# Altium schematic sheet full_bridge_converter.SchDoc (part 2 of 3)
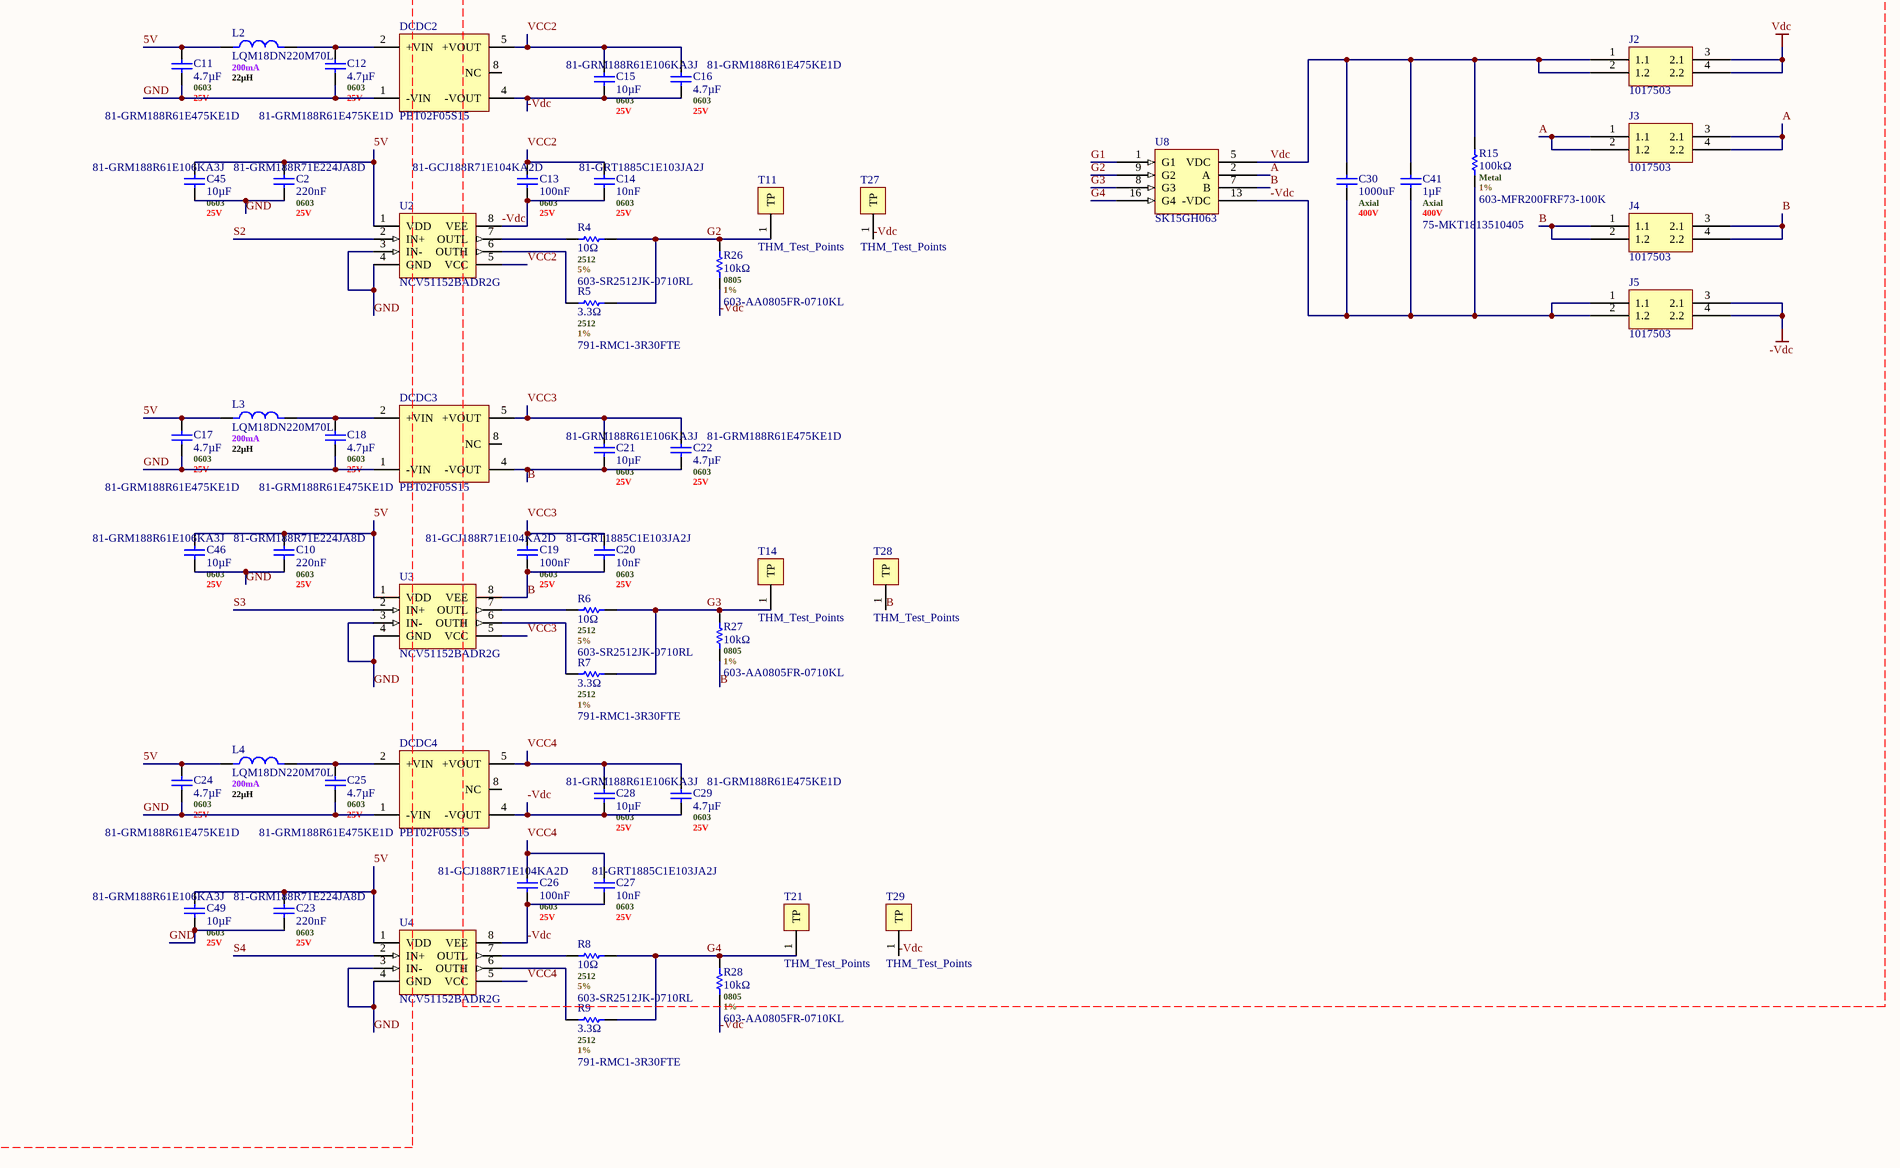
[diagram p4: full_bridge_converter.SchDoc, bottom right]
## Library data of the parts
C1 C2 C10 C23 = CAP_GRM188R71E224JA88D: Ceramic Capacitor, Ceramic, 25V, 5% +Tol, 5% -Tol, X7R, 15% TC, 0.22uF, Surface Mount, 0603; Manufacturer: Murata; Manufacturer Lifecycle Status: IN PRODUCTION; Supplier 1: Mouser; Manufacturer Part Number: GRM188R71E224JA88D; RoHS: Compliant; Category: Ceramic Capacitors; Stock 1: 27729; Pricing 1: 1=0,1, 10=0,038, 50=0,038, 100=0,032, 1000=0,021, 10000=0,016 (USD); Capacitance: 220nF; Case/Package: 0603; Dielectric: X7R; Dielectric Material: Ceramic; Height: 800µm; Length: 1.6mm; Lifecycle Status: Production; Material: Ceramic; Max Operating Temperature: 125°C; Min Operating Temperature: -55°C; Mount: Surface Mount; Number of Terminals: 2; REACH SVHC: Yes; Thickness: 800µm; Tolerance: 5%; Voltage Rating: 25V; Voltage Rating (DC): 25V; Width: 800µm; ComponentLink1URL: https://datasheet.octopart.com:443/GRM188R71E224JA88D-Murata-datasheet-141275257.pdf?src-supplier=Geoflip; ComponentLink1Description: https://datasheet.octopart.com:443/GRM188R71E224JA88D-Murata-datasheet-141275257.pdf?src-supplier=Geoflip; ComponentLink2URL: https://datasheet.octopart.com:443/GRM188R71E224JA88D-Murata-datasheet-155239114.pdf?src-supplier=element14+APAC; ComponentLink2Description: https://datasheet.octopart.com:443/GRM188R71E224JA88D-Murata-datasheet-155239114.pdf?src-supplier=element14+APAC; ComponentLink3URL: https://datasheet.octopart.com:443/GRM188R71E224JA88D-Murata-datasheet-165579666.pdf?src-supplier=TME; ComponentLink3Description: https://datasheet.octopart.com:443/GRM188R71E224JA88D-Murata-datasheet-165579666.pdf?src-supplier=TME; ComponentLink4URL: https://datasheet.octopart.com:443/GRM188R71E224JA88D-Murata-datasheet-140705547.pdf?src-supplier=Ciiva; ComponentLink4Description: https://datasheet.octopart.com:443/GRM188R71E224JA88D-Murata-datasheet-140705547.pdf?src-supplier=Ciiva; ComponentLink5URL: https://datasheet.octopart.com:443/GRM188R71E224JA88D-Murata-datasheet-138743095.pdf?src-supplier=Ciiva; ComponentLink5Description: https://datasheet.octopart.com:443/GRM188R71E224JA88D-Murata-datasheet-138743095.pdf?src-supplier=Ciiva; ComponentLink6URL: https://datasheet.octopart.com/GRM188R71E224JA88D-Murata-datasheet-12515295.pdf; ComponentLink6Description: https://datasheet.octopart.com/GRM188R71E224JA88D-Murata-datasheet-12515295.pdf; ComponentLink7URL: https://datasheet.octopart.com/GRM188R71E224JA88D-Murata-datasheet-12510076.pdf; ComponentLink7Description: https://datasheet.octopart.com/GRM188R71E224JA88D-Murata-datasheet-12510076.pdf; ComponentLink8URL: https://datasheet.octopart.com/GRM188R71E224JA88D-Murata-datasheet-11978611.pdf; ComponentLink8Description: https://datasheet.octopart.com/GRM188R71E224JA88D-Murata-datasheet-11978611.pdf; ComponentLink9URL: https://datasheet.octopart.com/GRM188R71E224JA88D-Murata-datasheet-10025737.pdf; ComponentLink9Description: https://datasheet.octopart.com/GRM188R71E224JA88D-Murata-datasheet-10025737.pdf; ComponentLink10URL: https://datasheet.octopart.com/GRM188R71E224JA88D-Murata-datasheet-8819587.pdf; ComponentLink10Description: https://datasheet.octopart.com/GRM188R71E224JA88D-Murata-datasheet-8819587.pdf; ComponentLink11URL: https://datasheet.octopart.com/GRM188R71E224JA88D-Murata-datasheet-38895632.pdf; ComponentLink11Description: https://datasheet.octopart.com/GRM188R71E224JA88D-Murata-datasheet-38895632.pdf; ComponentLink12URL: http://sigma.octopart.com:80/reach_statement/Murata-company-16.pdf?src-supplier=Compliance+Statements; ComponentLink12Description: http://sigma.octopart.com:80/reach_statement/Murata-company-16.pdf?src-supplier=Compliance+Statements
C3 = GCM31CR71C106KA4K: 16V 10uF X7R ±10% 1206 Multilayer Ceramic Capacitors MLCC - SMD/SMT ROHS; Manufacturer: Murata; Manufacturer Lifecycle Status: IN PRODUCTION; Supplier 1: Mouser; Manufacturer Part Number: GCM31CR71C106KA64K; RoHS: Compliant; Category: Ceramic Capacitors; Stock 1: 30347; Pricing 1: 1=0,45, 10=0,234, 50=0,234, 100=0,184, 1000=0,145, 10000=0,118 (USD); Capacitance: 10µF; Case/Package: 1206; Case Code (Imperial): 1206; Case Code (Metric): 3216; Depth: 1.6mm; Dielectric: X7R; Dielectric Material: Ceramic; Export Control Classification Number (ECCN) Code: EAR99; Height: 1.6mm; Harmonized Tariff Schedule (HTS) Code: 8532.24.00.20; Introduction Date: 2007-06-21; Length: 3.2mm; Lifecycle Status: Production; Material: Ceramic; Max Operating Temperature: 125°C; Min Operating Temperature: -55°C; Mount: Surface Mount; Number of Terminals: 2; Packaging: Tape & Reel; Radiation Hardening: No; REACH SVHC: Yes; Schedule B: 8532240020, 8532240020|8532240020, 8532240020|8532240020|8532240020, 8532240020|8532240020|8532240020|8532240020; Termination: SMD/SMT; Thickness: 1.6mm; Tolerance: 10%; Voltage Rating: 16V; Voltage Rating (DC): 16V; Width: 1.6mm; ComponentLink1URL: https://datasheet.octopart.com:443/GCM31CR71C106KA64K-Murata-datasheet-149522739.pdf?src-supplier=Newark; ComponentLink1Description: https://datasheet.octopart.com:443/GCM31CR71C106KA64K-Murata-datasheet-149522739.pdf?src-supplier=Newark; ComponentLink2URL: https://datasheet.octopart.com:443/GCM31CR71C106KA64K-Murata-datasheet-141269144.pdf?src-supplier=Geoflip; ComponentLink2Description: https://datasheet.octopart.com:443/GCM31CR71C106KA64K-Murata-datasheet-141269144.pdf?src-supplier=Geoflip; ComponentLink3URL: https://datasheet.octopart.com:443/GCM31CR71C106KA64K-Murata-datasheet-140661156.pdf?src-supplier=Ciiva; ComponentLink3Description: https://datasheet.octopart.com:443/GCM31CR71C106KA64K-Murata-datasheet-140661156.pdf?src-supplier=Ciiva; ComponentLink4URL: https://datasheet.octopart.com:443/GCM31CR71C106KA64K-Murata-datasheet-138720316.pdf?src-supplier=Ciiva; ComponentLink4Description: https://datasheet.octopart.com:443/GCM31CR71C106KA64K-Murata-datasheet-138720316.pdf?src-supplier=Ciiva; ComponentLink5URL: https://datasheet.octopart.com:443/GCM31CR71C106KA64K-Murata-datasheet-12511495.pdf?src-supplier=TME; ComponentLink5Description: https://datasheet.octopart.com:443/GCM31CR71C106KA64K-Murata-datasheet-12511495.pdf?src-supplier=TME; ComponentLink6URL: https://datasheet.octopart.com/GCM31CR71C106KA64K-Murata-datasheet-14404607.pdf; ComponentLink6Description: https://datasheet.octopart.com/GCM31CR71C106KA64K-Murata-datasheet-14404607.pdf; ComponentLink7URL: http://sigma.octopart.com:80/reach_statement/Murata-company-16.pdf?src-supplier=Compliance+Statements; ComponentLink7Description: http://sigma.octopart.com:80/reach_statement/Murata-company-16.pdf?src-supplier=Compliance+Statements
C4 C5 C9 C11 C12 C16-C18 C22 C24 C25 C29 = CAP_GRM188R61E475KE11D: 0603 4.7 uF 25 V ±10 % Tolerance X5R SMT Multilayer Ceramic Capacitor; Manufacturer: Murata; Manufacturer Lifecycle Status: IN PRODUCTION; Tolerance: 10%; Supplier 1: Mouser; Manufacturer Part Number: GRM188R61E475KE11D; RoHS: Compliant; Category: Ceramic Capacitors; Stock 1: 187011; Pricing 1: 1=0,1, 10=0,036, 50=0,036, 100=0,036, 1000=0,036, 10000=0,03 (USD); Capacitance: 4.7µF; Case/Package: 0603; Case Code (Imperial): 0603; Case Code (Metric): 1608; Depth: 800µm; Dielectric: X5R; Dielectric Material: Ceramic; Height: 800µm; Lead Free: Lead Free; Length: 1.6mm; Lifecycle Status: Production; Material: Ceramic; Max Operating Temperature: 85°C; Min Operating Temperature: -55°C; Mount: Surface Mount; Number of Terminals: 2; REACH SVHC: Yes; Schedule B: 8532240020, 8532240020|8532240020, 8532240020|8532240020|8532240020, 8532240020|8532240020|8532240020|8532240020; Thickness: 800µm; Voltage: 25V; Voltage Rating: 25V; Voltage Rating (DC): 25V; Width: 800µm; ComponentLink1URL: https://datasheet.octopart.com:443/GRM188R61E475KE11D-Murata-datasheet-27203393.pdf?src-supplier=Newark; ComponentLink1Description: https://datasheet.octopart.com:443/GRM188R61E475KE11D-Murata-datasheet-27203393.pdf?src-supplier=Newark; ComponentLink2URL: https://datasheet.octopart.com:443/GRM188R61E475KE11D-Murata-datasheet-44506546.pdf?src-supplier=Newark; ComponentLink2Description: https://datasheet.octopart.com:443/GRM188R61E475KE11D-Murata-datasheet-44506546.pdf?src-supplier=Newark; ComponentLink3URL: https://datasheet.octopart.com:443/GRM188R61E475KE11D-Murata-datasheet-62317199.pdf?src-supplier=element14+APAC; ComponentLink3Description: https://datasheet.octopart.com:443/GRM188R61E475KE11D-Murata-datasheet-62317199.pdf?src-supplier=element14+APAC; ComponentLink4URL: https://datasheet.octopart.com:443/GRM188R61E475KE11D-Murata-datasheet-14397282.pdf?src-supplier=Future+Electronics; ComponentLink4Description: https://datasheet.octopart.com:443/GRM188R61E475KE11D-Murata-datasheet-14397282.pdf?src-supplier=Future+Electronics; ComponentLink5URL: https://datasheet.octopart.com:443/GRM188R61E475KE11D-Murata-datasheet-78375012.pdf?src-supplier=Future+Electronics; ComponentLink5Description: https://datasheet.octopart.com:443/GRM188R61E475KE11D-Murata-datasheet-78375012.pdf?src-supplier=Future+Electronics; ComponentLink6URL: https://datasheet.octopart.com:443/GRM188R61E475KE11D-Murata-datasheet-179108037.pdf?src-supplier=Arrow.cn; ComponentLink6Description: https://datasheet.octopart.com:443/GRM188R61E475KE11D-Murata-datasheet-179108037.pdf?src-supplier=Arrow.cn; ComponentLink7URL: https://datasheet.octopart.com:443/GRM188R61E475KE11D-Murata-datasheet-165579666.pdf?src-supplier=TME; ComponentLink7Description: https://datasheet.octopart.com:443/GRM188R61E475KE11D-Murata-datasheet-165579666.pdf?src-supplier=TME; ComponentLink8URL: https://datasheet.octopart.com:443/GRM188R61E475KE11D-Murata-datasheet-141274968.pdf?src-supplier=Ciiva; ComponentLink8Description: https://datasheet.octopart.com:443/GRM188R61E475KE11D-Murata-datasheet-141274968.pdf?src-supplier=Ciiva; ComponentLink9URL: https://datasheet.octopart.com:443/GRM188R61E475KE11D-Murata-datasheet-140705133.pdf?src-supplier=Ciiva; ComponentLink9Description: https://datasheet.octopart.com:443/GRM188R61E475KE11D-Murata-datasheet-140705133.pdf?src-supplier=Ciiva; ComponentLink10URL: https://datasheet.octopart.com:443/GRM188R61E475KE11D-Murata-datasheet-138742897.pdf?src-supplier=Ciiva; ComponentLink10Description: https://datasheet.octopart.com:443/GRM188R61E475KE11D-Murata-datasheet-138742897.pdf?src-supplier=Ciiva; ComponentLink11URL: https://datasheet.octopart.com/GRM188R61E475KE11D-Murata-datasheet-12515295.pdf; ComponentLink11Description: https://datasheet.octopart.com/GRM188R61E475KE11D-Murata-datasheet-12515295.pdf; ComponentLink12URL: https://datasheet.octopart.com/GRM188R61E475KE11D-Murata-datasheet-12510076.pdf; ComponentLink12Description: https://datasheet.octopart.com/GRM188R61E475KE11D-Murata-datasheet-12510076.pdf; ComponentLink13URL: https://datasheet.octopart.com/GRM188R61E475KE11D-Murata-datasheet-11978611.pdf; ComponentLink13Description: https://datasheet.octopart.com/GRM188R61E475KE11D-Murata-datasheet-11978611.pdf; ComponentLink14URL: https://datasheet.octopart.com/GRM188R61E475KE11D-Murata-datasheet-10025737.pdf; ComponentLink14Description: https://datasheet.octopart.com/GRM188R61E475KE11D-Murata-datasheet-10025737.pdf; ComponentLink15URL: https://datasheet.octopart.com/GRM188R61E475KE11D-Murata-datasheet-8819587.pdf; ComponentLink15Description: https://datasheet.octopart.com/GRM188R61E475KE11D-Murata-datasheet-8819587.pdf; ComponentLink16URL: http://sigma.octopart.com:80/reach_statement/Murata-company-16.pdf?src-supplier=Compliance+Statements; ComponentLink16Description: http://sigma.octopart.com:80/reach_statement/Murata-company-16.pdf?src-supplier=Compliance+Statements
C6 C13 C19 C26 C37-C40 C43 C44 C47 C48 = CAP_GCJ188R71E104KA12D: Ceramic Capacitor, Ceramic, 25V, 10% +Tol, 10% -Tol, X7R, 15% TC, 0.1uF, Surface Mount, 0603; Manufacturer: Murata; Manufacturer Lifecycle Status: IN PRODUCTION; Supplier 1: Mouser; Manufacturer Part Number: GCJ188R71E104KA12D; RoHS: Compliant; Category: Ceramic Capacitors; Stock 1: 19671; Pricing 1: 1=0,13, 10=0,051, 50=0,051, 100=0,043, 1000=0,029, 10000=0,022 (USD); Capacitance: 100nF; Case/Package: 0603; Dielectric Material: Ceramic; Height: 800µm; Length: 1.6mm; Lifecycle Status: Production; Material: Ceramic; Max Operating Temperature: 125°C; Min Operating Temperature: -55°C; Mount: Surface Mount; Number of Terminals: 2; REACH SVHC: Yes; Schedule B: 8532240020, 8532240020|8532240020, 8532240020|8532240020|8532240020, 8532240020|8532240020|8532240020|8532240020; Thickness: 800µm; Tolerance: 10%; Voltage Rating: 25V; Voltage Rating (DC): 25V; Width: 800µm; ComponentLink1URL: https://datasheet.octopart.com:443/GCJ188R71E104KA12D-Murata-datasheet-149522263.pdf?src-supplier=Newark; ComponentLink1Description: https://datasheet.octopart.com:443/GCJ188R71E104KA12D-Murata-datasheet-149522263.pdf?src-supplier=Newark; ComponentLink2URL: https://datasheet.octopart.com:443/GCJ188R71E104KA12D-Murata-datasheet-141264622.pdf?src-supplier=Geoflip; ComponentLink2Description: https://datasheet.octopart.com:443/GCJ188R71E104KA12D-Murata-datasheet-141264622.pdf?src-supplier=Geoflip; ComponentLink3URL: https://datasheet.octopart.com:443/GCJ188R71E104KA12D-Murata-datasheet-140654708.pdf?src-supplier=Ciiva; ComponentLink3Description: https://datasheet.octopart.com:443/GCJ188R71E104KA12D-Murata-datasheet-140654708.pdf?src-supplier=Ciiva; ComponentLink4URL: https://datasheet.octopart.com:443/GCJ188R71E104KA12D-Murata-datasheet-138714381.pdf?src-supplier=Ciiva; ComponentLink4Description: https://datasheet.octopart.com:443/GCJ188R71E104KA12D-Murata-datasheet-138714381.pdf?src-supplier=Ciiva; ComponentLink5URL: https://datasheet.octopart.com:443/GCJ188R71E104KA12D-Murata-datasheet-165611796.pdf?src-supplier=TME; ComponentLink5Description: https://datasheet.octopart.com:443/GCJ188R71E104KA12D-Murata-datasheet-165611796.pdf?src-supplier=TME; ComponentLink6URL: http://sigma.octopart.com:80/reach_statement/Murata-company-16.pdf?src-supplier=Compliance+Statements; ComponentLink6Description: http://sigma.octopart.com:80/reach_statement/Murata-company-16.pdf?src-supplier=Compliance+Statements
C7 C14 C20 C27 = GRT1885C1E103JA02J: Multi-Layer Ceramic Capacitor 0.01uF 25VDC C0G 5% 0603 Paper T/R; Manufacturer: Murata; Manufacturer Lifecycle Status: IN PRODUCTION; Temperature Coefficient: 30ppm/°C; Supplier 1: Mouser; Manufacturer Part Number: GRT1885C1E103JA02J; RoHS: Compliant; Category: Ceramic Capacitors; Stock 1: 7621; Pricing 1: 1=0,15, 10=0,061, 50=0,061, 100=0,053, 1000=0,036, 10000=0,025 (USD); Capacitance: 10nF; Case/Package: 0603; Dielectric Material: Ceramic; Height: 800µm; Length: 1.6mm; Lifecycle Status: Production; Material: Ceramic; Max Operating Temperature: 125°C; Min Operating Temperature: -55°C; Mount: Surface Mount; Number of Terminals: 2; REACH SVHC: Yes; Thickness: 800µm; Tolerance: 5%; Voltage Rating: 25V; Voltage Rating (DC): 25V; Width: 800µm; ComponentLink1URL: https://datasheet.octopart.com:443/GRT1885C1E103JA02J-Murata-datasheet-141284073.pdf?src-supplier=Geoflip; ComponentLink1Description: https://datasheet.octopart.com:443/GRT1885C1E103JA02J-Murata-datasheet-141284073.pdf?src-supplier=Geoflip; ComponentLink2URL: https://datasheet.octopart.com:443/GRT1885C1E103JA02J-Murata-datasheet-140711081.pdf?src-supplier=Ciiva; ComponentLink2Description: https://datasheet.octopart.com:443/GRT1885C1E103JA02J-Murata-datasheet-140711081.pdf?src-supplier=Ciiva; ComponentLink3URL: https://datasheet.octopart.com:443/GRT1885C1E103JA02J-Murata-datasheet-138748798.pdf?src-supplier=Ciiva; ComponentLink3Description: https://datasheet.octopart.com:443/GRT1885C1E103JA02J-Murata-datasheet-138748798.pdf?src-supplier=Ciiva; ComponentLink4URL: http://sigma.octopart.com:80/reach_statement/Murata-company-16.pdf?src-supplier=Compliance+Statements; ComponentLink4Description: http://sigma.octopart.com:80/reach_statement/Murata-company-16.pdf?src-supplier=Compliance+Statements
C8 C15 C21 C28 C42 C45 C46 C49 = CAP_GRM188R61E106KA73J: Multilayer Ceramic Capacitor, 10 uF, 25 V, 10%, X5R, 0603 1608 Metric - T/R; Manufacturer: Murata; Manufacturer Lifecycle Status: IN PRODUCTION; Supplier 1: Mouser; Manufacturer Part Number: GRM188R61E106KA73J; RoHS: Compliant; Category: Ceramic Capacitors; Stock 1: 115551; Pricing 1: 1=0,23, 10=0,097, 50=0,097, 100=0,086, 1000=0,06, 10000=0,047 (USD); Capacitance: 10µF; Case/Package: 0603; Dielectric: X5R; Dielectric Material: Ceramic; Height: 800µm; Length: 1.6mm; Lifecycle Status: Production; Material: Ceramic; Max Operating Temperature: 85°C; Min Operating Temperature: -55°C; Mount: Surface Mount; Number of Terminals: 2; REACH SVHC: Yes; Thickness: 800µm; Tolerance: 10%; Voltage Rating: 25V; Voltage Rating (DC): 25V; Width: 800µm; ComponentLink1URL: https://datasheet.octopart.com:443/GRM188R61E106KA73J-Murata-datasheet-165579666.pdf?src-supplier=TME; ComponentLink1Description: https://datasheet.octopart.com:443/GRM188R61E106KA73J-Murata-datasheet-165579666.pdf?src-supplier=TME; ComponentLink2URL: https://datasheet.octopart.com:443/GRM188R61E106KA73J-Murata-datasheet-141274968.pdf?src-supplier=Ciiva; ComponentLink2Description: https://datasheet.octopart.com:443/GRM188R61E106KA73J-Murata-datasheet-141274968.pdf?src-supplier=Ciiva; ComponentLink3URL: https://datasheet.octopart.com:443/GRM188R61E106KA73J-Murata-datasheet-140704821.pdf?src-supplier=Ciiva; ComponentLink3Description: https://datasheet.octopart.com:443/GRM188R61E106KA73J-Murata-datasheet-140704821.pdf?src-supplier=Ciiva; ComponentLink4URL: https://datasheet.octopart.com:443/GRM188R61E106KA73J-Murata-datasheet-138742889.pdf?src-supplier=Ciiva; ComponentLink4Description: https://datasheet.octopart.com:443/GRM188R61E106KA73J-Murata-datasheet-138742889.pdf?src-supplier=Ciiva; ComponentLink5URL: https://datasheet.octopart.com/GRM188R61E106KA73J-Murata-datasheet-12515295.pdf; ComponentLink5Description: https://datasheet.octopart.com/GRM188R61E106KA73J-Murata-datasheet-12515295.pdf; ComponentLink6URL: https://datasheet.octopart.com/GRM188R61E106KA73J-Murata-datasheet-12510076.pdf; ComponentLink6Description: https://datasheet.octopart.com/GRM188R61E106KA73J-Murata-datasheet-12510076.pdf; ComponentLink7URL: https://datasheet.octopart.com/GRM188R61E106KA73J-Murata-datasheet-11978611.pdf; ComponentLink7Description: https://datasheet.octopart.com/GRM188R61E106KA73J-Murata-datasheet-11978611.pdf; ComponentLink8URL: https://datasheet.octopart.com/GRM188R61E106KA73J-Murata-datasheet-10025737.pdf; ComponentLink8Description: https://datasheet.octopart.com/GRM188R61E106KA73J-Murata-datasheet-10025737.pdf; ComponentLink9URL: https://datasheet.octopart.com/GRM188R61E106KA73J-Murata-datasheet-8819587.pdf; ComponentLink9Description: https://datasheet.octopart.com/GRM188R61E106KA73J-Murata-datasheet-8819587.pdf; ComponentLink10URL: http://sigma.octopart.com:80/reach_statement/Murata-company-16.pdf?src-supplier=Compliance+Statements; ComponentLink10Description: http://sigma.octopart.com:80/reach_statement/Murata-company-16.pdf?src-supplier=Compliance+Statements
C30 = Pana_400_1000: Capacitance: 1000uF; Voltage Rating (DC): 400V; Voltage: 400V; Case/Package: Axial
C32-C35 = CAP_Kemet_C0603C471K8HACAUTO: Cap, 470Pf, 10V, Mlcc, 0603 Rohs Compliant: Yes |Kemet C0603C471K8HACAUTO; Manufacturer: KEMET; Dielectric: X8R; Dielectric Material: Ceramic; Temperature Coefficient: 30ppm/°C; Supplier 1: Mouser; Manufacturer Part Number: C0603C471K8HACAUTO; RoHS: Compliant; Category: Ceramic Capacitors; Stock 1: 9072; Pricing 1: 1=0,1, 10=0,036, 50=0,036, 100=0,031, 1000=0,021, 10000=0,012 (USD); Capacitance: 470pF; Case/Package: 0603; China RoHS: Compliant; Height: 800µm; Lead Free: Lead Free; Length: 1.6mm; Lifecycle Status: Production; Material: Ceramic; Max Operating Temperature: 150°C; Min Operating Temperature: -55°C; Mount: Surface Mount; Number of Terminals: 2; REACH SVHC: Yes; Voltage Rating: 10V; Voltage Rating (DC): 10V; Width: 800µm; ComponentLink1URL: https://datasheet.octopart.com:443/C0603C471K8HACAUTO-KEMET-datasheet-178087918.pdf?src-supplier=IHS; ComponentLink1Description: https://datasheet.octopart.com:443/C0603C471K8HACAUTO-KEMET-datasheet-178087918.pdf?src-supplier=IHS; ComponentLink2URL: https://datasheet.octopart.com:443/C0603C471K8HACAUTO-KEMET-datasheet-137357764.pdf?src-supplier=Upverter; ComponentLink2Description: https://datasheet.octopart.com:443/C0603C471K8HACAUTO-KEMET-datasheet-137357764.pdf?src-supplier=Upverter; ComponentLink3URL: https://datasheet.octopart.com:443/C0603C471K8HACAUTO-KEMET-datasheet-189885776.pdf?src-supplier=element14+APAC; ComponentLink3Description: https://datasheet.octopart.com:443/C0603C471K8HACAUTO-KEMET-datasheet-189885776.pdf?src-supplier=element14+APAC; ComponentLink4URL: https://datasheet.octopart.com:443/C0603C471K8HACAUTO-KEMET-datasheet-170520340.pdf?src-supplier=Newark; ComponentLink4Description: https://datasheet.octopart.com:443/C0603C471K8HACAUTO-KEMET-datasheet-170520340.pdf?src-supplier=Newark; ComponentLink5URL: https://datasheet.octopart.com:443/C0603C471K8HACAUTO-KEMET-datasheet-154276014.pdf?src-supplier=Farnell; ComponentLink5Description: https://datasheet.octopart.com:443/C0603C471K8HACAUTO-KEMET-datasheet-154276014.pdf?src-supplier=Farnell; ComponentLink6URL: https://datasheet.octopart.com/C0603C471K8HACAUTO-KEMET-datasheet-84169754.pdf; ComponentLink6Description: https://datasheet.octopart.com/C0603C471K8HACAUTO-KEMET-datasheet-84169754.pdf
C41 = MKT1813510405: Film Capacitor, Polyester, 400V, 10% +Tol, 10% -Tol, 1uF, Through Hole Mount; Manufacturer: Vishay; Dielectric: PET; Lead Diameter: 800µm; Lead Length: 40mm; Life (Hours): 300000hours; Voltage Rating (AC): 200V; Supplier 1: Mouser; Manufacturer Part Number: MKT1813510405; RoHS: Compliant; Category: Film Capacitors; Stock 1: 114; Pricing 1: 1=4,13, 10=3, 50=2,48, 100=2,31, 1000=1,72, 10000=1,54 (USD); Capacitance: 1µF; Case/Package: Axial; China RoHS: Compliant; Diameter: 13.5mm; Dielectric Material: Polyester; Export Control Classification Number (ECCN) Code: EAR99; Harmonized Tariff Schedule (HTS) Code: 8532.25.00.60; Introduction Date: 2000-11-01; Length: 31.5mm; Lifecycle Status: Production; Max Operating Temperature: 100°C; Min Operating Temperature: -55°C; Mount: Through Hole; Number of Pins: 1813; Number of Terminals: 2; Packaging: Bulk; Radiation Hardening: No; REACH SVHC: Yes; Termination: Axial; Tolerance: 10%; Voltage: 400V; Voltage Rating (DC): 400V; ComponentLink1URL: https://datasheet.octopart.com:443/MKT1813-510-405-Vishay-datasheet-181963145.pdf?src-supplier=IHS; ComponentLink1Description: https://datasheet.octopart.com:443/MKT1813-510-405-Vishay-datasheet-181963145.pdf?src-supplier=IHS; ComponentLink2URL: https://datasheet.octopart.com:443/MKT1813510405-Vishay-datasheet-26824198.pdf?src-supplier=Farnell; ComponentLink2Description: https://datasheet.octopart.com:443/MKT1813510405-Vishay-datasheet-26824198.pdf?src-supplier=Farnell; ComponentLink3URL: https://datasheet.octopart.com:443/MKT1813510405-Vishay-datasheet-159614172.pdf?src-supplier=Farnell; ComponentLink3Description: https://datasheet.octopart.com:443/MKT1813510405-Vishay-datasheet-159614172.pdf?src-supplier=Farnell; ComponentLink4URL: https://datasheet.octopart.com:443/MKT1813510405-Vishay-datasheet-8454534.pdf?src-supplier=Farnell; ComponentLink4Description: https://datasheet.octopart.com:443/MKT1813510405-Vishay-datasheet-8454534.pdf?src-supplier=Farnell; ComponentLink5URL: https://datasheet.octopart.com:443/MKT1813510405-Vishay-datasheet-638509.pdf?src-supplier=Farnell; ComponentLink5Description: https://datasheet.octopart.com:443/MKT1813510405-Vishay-datasheet-638509.pdf?src-supplier=Farnell; ComponentLink6URL: https://datasheet.octopart.com:443/MKT1813510405-Vishay-datasheet-164876301.pdf?src-supplier=Burklin+Elektronik; ComponentLink6Description: https://datasheet.octopart.com:443/MKT1813510405-Vishay-datasheet-164876301.pdf?src-supplier=Burklin+Elektronik; ComponentLink7URL: https://datasheet.octopart.com:443/MKT1813510405-Vishay-datasheet-11745928.pdf?src-supplier=Arrow+Electronics; ComponentLink7Description: https://datasheet.octopart.com:443/MKT1813510405-Vishay-datasheet-11745928.pdf?src-supplier=Arrow+Electronics; ComponentLink8URL: https://datasheet.octopart.com:443/MKT1813510405-Vishay-datasheet-161884.pdf?src-supplier=Mouser; ComponentLink8Description: https://datasheet.octopart.com:443/MKT1813510405-Vishay-datasheet-161884.pdf?src-supplier=Mouser; ComponentLink9URL: https://datasheet.octopart.com:443/MKT1813510405-Vishay-datasheet-9388.pdf?src-supplier=Newark; ComponentLink9Description: https://datasheet.octopart.com:443/MKT1813510405-Vishay-datasheet-9388.pdf?src-supplier=Newark; ComponentLink10URL: http://sigma.octopart.com:80/rohs_statement/Vishay-company-15.pdf?src-supplier=Compliance+Statements; ComponentLink10Description: http://sigma.octopart.com:80/rohs_statement/Vishay-company-15.pdf?src-supplier=Compliance+Statements
D5 R24 = RC0805JR-101KL: Res Thick Film 0805 1K Ohm 5% 0.125W(1/8W) ±100ppm/C Pad SMD T/R; Manufacturer: Yageo Group; Power Dissipation: 125mW; Temperature Coefficient: 100ppm/°C; Voltage Rating: 150V; Supplier 1: Mouser; Manufacturer Part Number: RC0805JR-101KL; RoHS: Compliant; Category: Chip SMD Resistors; Stock 1: 25236; Pricing 1: 1=0,1, 10=0,010, 50=0,010, 100=0,006, 1000=0,006, 10000=0,004 (USD); Case/Package: 0805; Case Code (Imperial): 0805; Case Code (Metric): 2012; China RoHS: Non-Compliant; Composition: Thick Film; Contact Plating: Tin; Country of Origin: Mainland China, Taiwan; Depth: 1.25mm; Export Control Classification Number (ECCN) Code: EAR99; Height: 500µm; Harmonized Tariff Schedule (HTS) Code: 8533.21.00.30; Introduction Date: 2004-09-22; Length: 2mm; Lifecycle Status: Production; Max Operating Temperature: 155°C; Military Standard: Not; Min Operating Temperature: -55°C; Mount: Surface Mount; Number of Pins: 2; Number of Terminals: 2; Packaging: Tape & Reel; Power Rating: 125mW; Radiation Hardening: No; REACH SVHC: Yes; Resistance: 1kΩ; Schedule B: 8533210045; Termination: SMD/SMT; Tolerance: 5%; Voltage Rating (DC): 150V; Width: 1.25mm; Working Voltage: 150V; ComponentLink1URL: https://datasheet.octopart.com:443/RC0805JR-101KL-Yageo-datasheet-175887523.pdf?src-supplier=IHS; ComponentLink1Description: https://datasheet.octopart.com:443/RC0805JR-101KL-Yageo-datasheet-175887523.pdf?src-supplier=IHS; ComponentLink2URL: https://datasheet.octopart.com:443/RC0805JR-101KL-Yageo-datasheet-8330313.pdf?src-supplier=element14+APAC; ComponentLink2Description: https://datasheet.octopart.com:443/RC0805JR-101KL-Yageo-datasheet-8330313.pdf?src-supplier=element14+APAC; ComponentLink3URL: https://datasheet.octopart.com/RC0805JR-101KL-Yageo-datasheet-73766026.pdf; ComponentLink3Description: https://datasheet.octopart.com/RC0805JR-101KL-Yageo-datasheet-73766026.pdf; ComponentLink4URL: http://sigma.octopart.com:80/conflict_mineral_statement/Yageo-company-3.pdf?src-supplier=Compliance+Statements; ComponentLink4Description: http://sigma.octopart.com:80/conflict_mineral_statement/Yageo-company-3.pdf?src-supplier=Compliance+Statements; ComponentLink5URL: http://sigma.octopart.com:80/rohs_statement/Yageo-company-2.pdf?src-supplier=Compliance+Statements; ComponentLink5Description: http://sigma.octopart.com:80/rohs_statement/Yageo-company-2.pdf?src-supplier=Compliance+Statements
J6-J9 = HFBR-0500ETZ: Receptor Connector Optical Fiber
L1-L4 = LQM18DN220M70L: Inductor Power Shielded Multi-Layer 22uH 20% 1MHz Ferrite 0.2A 3.12Ohm DCR 0603 T/R; Manufacturer: Murata; DC Resistance (DCR): 3.12Ω; Number of Circuits: 1; Saturation Current: 50mA; Self Resonant Frequency: 15MHz; Shielding: Yes; Supplier 1: Mouser; Manufacturer Part Number: LQM18DN220M70L; RoHS: Compliant; Category: Fixed Inductors; Stock 1: 8810; Pricing 1: 1=0,12, 10=0,096, 50=0,096, 100=0,079, 1000=0,065, 10000=0,053 (USD); Case/Package: 0603; Core Material: Ferrite; Height: 800µm; Inductance: 22µH; Lifecycle Status: Production; Max Current Rating: 200mA; Max Operating Temperature: 125°C; Min Operating Temperature: -55°C; Number of Terminals: 2; REACH SVHC: Yes; Resistance: 3.12Ω; RMS Current (Irms): 200mA; Series Resistance: 3.12Ω; Test Frequency: 1MHz; Tolerance: 20%; Width: 800µm; ComponentLink1URL: http://sigma.octopart.com:80/reach_statement/Murata-company-16.pdf?src-supplier=Compliance+Statements; ComponentLink1Description: http://sigma.octopart.com:80/reach_statement/Murata-company-16.pdf?src-supplier=Compliance+Statements
R2 R4 R6 R8 = SR2512JK-0710RL: Fixed Resistor, Metal Glaze/thick Film, 1W, 10ohm, 500V, 5% +/-Tol, 100ppm/Cel, Surface Mount, 2512; Manufacturer: Yageo Group; Temperature Coefficient: 100ppm/°C; Supplier 1: Mouser; Manufacturer Part Number: SR2512JK-0710RL; RoHS: Compliant; Category: Chip SMD Resistors; Stock 1: 10268; Pricing 1: 1=0,17, 10=0,099, 50=0,089, 100=0,08, 1000=0,069, 10000=0,069 (USD); Case/Package: 2512; China RoHS: Non-Compliant; Composition: Thick Film; Features: Automotive AEC-Q200; Height: 550µm; Length: 6.35mm; Lifecycle Status: Production; Max Operating Temperature: 155°C; Max Power Dissipation: 1W; Min Operating Temperature: -55°C; Mount: Surface Mount; Number of Terminals: 2; Number of Terminations: 2; Power Dissipation: 1W; REACH SVHC: Yes; Resistance: 10Ω; Tolerance: 5%; Width: 3.1mm; Working Voltage: 500V; ComponentLink1URL: https://datasheet.octopart.com:443/SR2512JK-0710RL-Yageo-datasheet-176402240.pdf?src-supplier=Newark; ComponentLink1Description: https://datasheet.octopart.com:443/SR2512JK-0710RL-Yageo-datasheet-176402240.pdf?src-supplier=Newark; ComponentLink2URL: https://datasheet.octopart.com:443/SR2512JK-0710RL-Yageo-datasheet-166006509.pdf?src-supplier=Future+Electronics; ComponentLink2Description: https://datasheet.octopart.com:443/SR2512JK-0710RL-Yageo-datasheet-166006509.pdf?src-supplier=Future+Electronics; ComponentLink3URL: https://datasheet.octopart.com/SR2512JK-0710RL-Yageo-datasheet-11047080.pdf; ComponentLink3Description: https://datasheet.octopart.com/SR2512JK-0710RL-Yageo-datasheet-11047080.pdf; ComponentLink4URL: http://sigma.octopart.com:80/conflict_mineral_statement/Yageo-company-3.pdf?src-supplier=Compliance+Statements; ComponentLink4Description: http://sigma.octopart.com:80/conflict_mineral_statement/Yageo-company-3.pdf?src-supplier=Compliance+Statements; ComponentLink5URL: http://sigma.octopart.com:80/rohs_statement/Yageo-company-2.pdf?src-supplier=Compliance+Statements; ComponentLink5Description: http://sigma.octopart.com:80/rohs_statement/Yageo-company-2.pdf?src-supplier=Compliance+Statements
R3 R5 R7 R9 = RMC1-3R30FTE: Fixed Resistor, Metal Glaze/thick Film, 1W, 3.3ohm, 200V, 1% +/-Tol, 500ppm/Cel, Surface Mount, 2512; Manufacturer: Kamaya; Temperature Coefficient: 500ppm/°C; Supplier 1: Mouser; Manufacturer Part Number: RMC1-3R30FTE; RoHS: Compliant; Category: Chip SMD Resistors; Stock 1: 1779; Pricing 1: 1=0,2, 10=0,097, 50=0,097, 100=0,056, 1000=0,034, 10000=0,024 (USD); China RoHS: Non-Compliant; Height: 550µm; Lifecycle Status: Production; Max Operating Temperature: 155°C; Min Operating Temperature: -55°C; Mount: Surface Mount; Number of Terminals: 2; Power Dissipation: 1W; REACH SVHC: Yes; Resistance: 3.3Ω; Tolerance: 1%; Width: 3.2mm; Working Voltage: 200V; ComponentLink1URL: https://datasheet.octopart.com:443/RMC1-3R30FTE-Kamaya-datasheet-182142873.pdf?src-supplier=IHS; ComponentLink1Description: https://datasheet.octopart.com:443/RMC1-3R30FTE-Kamaya-datasheet-182142873.pdf?src-supplier=IHS; Case/Package: 2512
R11 R12 R16 R17 = RESISTOR - GENERIC: Res Thick Film 0603 3.09K Ohm 1% 0.1W(1/10W) ±100ppm/C Pad SMD T/R; Manufacturer: Yageo Group; Manufacturer Part Number: RC0603FR-073K09L; Power Dissipation: 100mW; Temperature Coefficient: 100ppm/°C; Voltage Rating: 75V; Voltage Rating (DC): 50V; Supplier 1: Mouser; RoHS: Compliant; Category: Chip SMD Resistors; Stock 1: 1028569; Pricing 1: 1=0,1, 10=0,007, 50=0,007, 100=0,006, 1000=0,006, 10000=0,002 (USD); Case/Package: 0603; Case Code (Imperial): 0603; China RoHS: Non-Compliant; Composition: Thick Film; Depth: 800µm; Height: 450µm; Lead Free: Lead Free; Length: 1.6mm; Lifecycle Status: Production; Max Operating Temperature: 155°C; Military Standard: Not; Min Operating Temperature: -55°C; Mount: Surface Mount; Number of Terminals: 2; Packaging: Tape & Reel; Power Rating: 100mW; REACH SVHC: Yes; Resistance: 3.09kΩ; Schedule B: 8533210045, 8533210045|8533210045|8533210045|8533210045|8533210045; Termination: SMD/SMT; Tolerance: 1%; Width: 800µm; Working Voltage: 75V; ComponentLink1URL: https://datasheet.octopart.com:443/RC0603FR-073K09L-Yageo-datasheet-175887523.pdf?src-supplier=Newark; ComponentLink1Description: https://datasheet.octopart.com:443/RC0603FR-073K09L-Yageo-datasheet-175887523.pdf?src-supplier=Newark; ComponentLink2URL: https://datasheet.octopart.com:443/RC0603FR-073K09L-Yageo-datasheet-103092701.pdf?src-supplier=Upverter; ComponentLink2Description: https://datasheet.octopart.com:443/RC0603FR-073K09L-Yageo-datasheet-103092701.pdf?src-supplier=Upverter; ComponentLink3URL: https://datasheet.octopart.com:443/RC0603FR-073K09L-Yageo-datasheet-164759695.pdf?src-supplier=Future+Electronics; ComponentLink3Description: https://datasheet.octopart.com:443/RC0603FR-073K09L-Yageo-datasheet-164759695.pdf?src-supplier=Future+Electronics; ComponentLink4URL: https://datasheet.octopart.com:443/RC0603FR-073K09L-Yageo-datasheet-137700087.pdf?src-supplier=Future+Electronics; ComponentLink4Description: https://datasheet.octopart.com:443/RC0603FR-073K09L-Yageo-datasheet-137700087.pdf?src-supplier=Future+Electronics; ComponentLink5URL: https://datasheet.octopart.com:443/RC0603FR-073K09L-Yageo-datasheet-15599030.pdf?src-supplier=Future+Electronics; ComponentLink5Description: https://datasheet.octopart.com:443/RC0603FR-073K09L-Yageo-datasheet-15599030.pdf?src-supplier=Future+Electronics; ComponentLink6URL: https://datasheet.octopart.com:443/RC0603FR-073K09L-Yageo-datasheet-12596169.pdf?src-supplier=Future+Electronics; ComponentLink6Description: https://datasheet.octopart.com:443/RC0603FR-073K09L-Yageo-datasheet-12596169.pdf?src-supplier=Future+Electronics; ComponentLink7URL: https://datasheet.octopart.com:443/RC0603FR-073K09L-Yageo-datasheet-8328172.pdf?src-supplier=Future+Electronics; ComponentLink7Description: https://datasheet.octopart.com:443/RC0603FR-073K09L-Yageo-datasheet-8328172.pdf?src-supplier=Future+Electronics; ComponentLink8URL: https://datasheet.octopart.com:443/RC0603FR-073K09L-Yageo-datasheet-8324193.pdf?src-supplier=Future+Electronics; ComponentLink8Description: https://datasheet.octopart.com:443/RC0603FR-073K09L-Yageo-datasheet-8324193.pdf?src-supplier=Future+Electronics; ComponentLink9URL: https://datasheet.octopart.com/RC0603FR-073K09L-Yageo-datasheet-73766026.pdf; ComponentLink9Description: https://datasheet.octopart.com/RC0603FR-073K09L-Yageo-datasheet-73766026.pdf; ComponentLink10URL: https://datasheet.octopart.com:443/RC0603FR-073K09L-Yageo-datasheet-118562.pdf?src-supplier=DigiKey; ComponentLink10Description: https://datasheet.octopart.com:443/RC0603FR-073K09L-Yageo-datasheet-118562.pdf?src-supplier=DigiKey; ComponentLink11URL: http://sigma.octopart.com:80/conflict_mineral_statement/Yageo-company-3.pdf?src-supplier=Compliance+Statements; ComponentLink11Description: http://sigma.octopart.com:80/conflict_mineral_statement/Yageo-company-3.pdf?src-supplier=Compliance+Statements; ComponentLink12URL: http://sigma.octopart.com:80/rohs_statement/Yageo-company-2.pdf?src-supplier=Compliance+Statements; ComponentLink12Description: http://sigma.octopart.com:80/rohs_statement/Yageo-company-2.pdf?src-supplier=Compliance+Statements
R13 R14 R18 R19 = RC0603JR-0710KL: Res Thick Film 0603 10K Ohm 5% 1/10W ±100ppm/°C Molded SMD SMD Paper T/R; Manufacturer: Yageo Group; Power Dissipation: 100mW; Voltage Rating: 50V; Working Voltage: 75V; Supplier 1: Mouser; Manufacturer Part Number: RC0603JR-0710KL; RoHS: Compliant; Category: Chip SMD Resistors; Stock 1: 1014331; Pricing 1: 1=0,1, 10=0,008, 50=0,008, 100=0,006, 1000=0,005, 10000=0,002 (USD); Case/Package: 0603; Case Code (Imperial): 0603; China RoHS: Non-Compliant; Composition: Thick Film; Contact Plating: Tin; Depth: 800µm; Height: 450µm; Lead Free: Lead Free; Length: 1.6mm; Lifecycle Status: Production; Max Operating Temperature: 155°C; Military Standard: Not; Min Operating Temperature: -55°C; Mount: Surface Mount; Number of Pins: 2; Number of Terminals: 2; Packaging: Tape & Reel; Power Rating: 100mW; Radiation Hardening: No; REACH SVHC: Yes; Resistance: 10kΩ; Schedule B: 8533210045, 8533210045|8533210045|8533210045|8533210045|8533210045|8533210045|8533210045|8533210045|8533210045|8533210045|8533210045|8533210045|8533210045|8533210045, 8533210045|8533210045|8533210045|8533210045|8533210045|8533210045|8533210045|8533210045|8533210045|8533210045|8533210045|8533210045|8533210045|8533210045|8533210045, 8533210045|8533210045|8533210045|8533210045|8533210045|8533210045|8533210045|8533210045|8533210045|8533210045|8533210045|8533210045|8533210045|8533210045|8533210045|8533210045; Temperature Coefficient: 100ppm/°C; Termination: SMD/SMT; Tolerance: 5%; Voltage Rating (AC): 50V; Voltage Rating (DC): 50V; Width: 800µm; ComponentLink1URL: https://datasheet.octopart.com:443/RC0603JR-0710KL-Yageo-datasheet-175887523.pdf?src-supplier=IHS; ComponentLink1Description: https://datasheet.octopart.com:443/RC0603JR-0710KL-Yageo-datasheet-175887523.pdf?src-supplier=IHS; ComponentLink2URL: https://datasheet.octopart.com:443/RC0603JR-0710KL-Yageo-datasheet-8328172.pdf?src-supplier=element14+APAC; ComponentLink2Description: https://datasheet.octopart.com:443/RC0603JR-0710KL-Yageo-datasheet-8328172.pdf?src-supplier=element14+APAC; ComponentLink3URL: https://datasheet.octopart.com:443/RC0603JR-0710KL-Yageo-datasheet-62067350.pdf?src-supplier=element14+APAC; ComponentLink3Description: https://datasheet.octopart.com:443/RC0603JR-0710KL-Yageo-datasheet-62067350.pdf?src-supplier=element14+APAC; ComponentLink4URL: https://datasheet.octopart.com:443/RC0603JR-0710KL-Yageo-datasheet-77992522.pdf?src-supplier=Upverter; ComponentLink4Description: https://datasheet.octopart.com:443/RC0603JR-0710KL-Yageo-datasheet-77992522.pdf?src-supplier=Upverter; ComponentLink5URL: https://datasheet.octopart.com:443/RC0603JR-0710KL-Yageo-datasheet-34211833.pdf?src-supplier=Newark; ComponentLink5Description: https://datasheet.octopart.com:443/RC0603JR-0710KL-Yageo-datasheet-34211833.pdf?src-supplier=Newark; ComponentLink6URL: https://datasheet.octopart.com:443/RC0603JR-0710KL-Yageo-datasheet-164759695.pdf?src-supplier=Future+Electronics; ComponentLink6Description: https://datasheet.octopart.com:443/RC0603JR-0710KL-Yageo-datasheet-164759695.pdf?src-supplier=Future+Electronics; ComponentLink7URL: https://datasheet.octopart.com:443/RC0603JR-0710KL-Yageo-datasheet-137700087.pdf?src-supplier=Future+Electronics; ComponentLink7Description: https://datasheet.octopart.com:443/RC0603JR-0710KL-Yageo-datasheet-137700087.pdf?src-supplier=Future+Electronics; ComponentLink8URL: https://datasheet.octopart.com:443/RC0603JR0710KL-Yageo-datasheet-27584510.pdf?src-supplier=Future+Electronics; ComponentLink8Description: https://datasheet.octopart.com:443/RC0603JR0710KL-Yageo-datasheet-27584510.pdf?src-supplier=Future+Electronics; ComponentLink9URL: https://datasheet.octopart.com:443/RC0603JR-0710KL-Yageo-datasheet-15599030.pdf?src-supplier=Future+Electronics; ComponentLink9Description: https://datasheet.octopart.com:443/RC0603JR-0710KL-Yageo-datasheet-15599030.pdf?src-supplier=Future+Electronics; ComponentLink10URL: https://datasheet.octopart.com:443/RC0603JR0710KL-Yageo-datasheet-12596169.pdf?src-supplier=Future+Electronics; ComponentLink10Description: https://datasheet.octopart.com:443/RC0603JR0710KL-Yageo-datasheet-12596169.pdf?src-supplier=Future+Electronics; ComponentLink11URL: https://datasheet.octopart.com:443/RC0603JR-0710KL-Yageo-datasheet-8324193.pdf?src-supplier=Future+Electronics; ComponentLink11Description: https://datasheet.octopart.com:443/RC0603JR-0710KL-Yageo-datasheet-8324193.pdf?src-supplier=Future+Electronics; ComponentLink12URL: https://datasheet.octopart.com/RC0603JR-0710KL-Yageo-datasheet-73766026.pdf; ComponentLink12Description: https://datasheet.octopart.com/RC0603JR-0710KL-Yageo-datasheet-73766026.pdf; ComponentLink13URL: https://datasheet.octopart.com:443/RC0603JR-0710KL-Yageo-datasheet-118562.pdf?src-supplier=DigiKey; ComponentLink13Description: https://datasheet.octopart.com:443/RC0603JR-0710KL-Yageo-datasheet-118562.pdf?src-supplier=DigiKey; ComponentLink14URL: http://sigma.octopart.com:80/conflict_mineral_statement/Yageo-company-3.pdf?src-supplier=Compliance+Statements; ComponentLink14Description: http://sigma.octopart.com:80/conflict_mineral_statement/Yageo-company-3.pdf?src-supplier=Compliance+Statements; ComponentLink15URL: http://sigma.octopart.com:80/rohs_statement/Yageo-company-2.pdf?src-supplier=Compliance+Statements; ComponentLink15Description: http://sigma.octopart.com:80/rohs_statement/Yageo-company-2.pdf?src-supplier=Compliance+Statements
R15 = MFR200FRF73-100K: Fixed Resistor, Metal Film, 2W, 100000ohm, 500V, 1% +/-Tol, 100ppm/Cel, Through Hole Mount; Manufacturer: Yageo Group; Lead Diameter: 800µm; Temperature Coefficient: 100ppm/°C; Supplier 1: Mouser; Manufacturer Part Number: MFR200FRF73-100K; RoHS: Compliant; Category: Through-Hole Resistors; Stock 1: 2527; Pricing 1: 1=0,39, 10=0,285, 50=0,217, 100=0,128, 1000=0,079, 10000=0,064 (USD); Case/Package: Metal; China RoHS: Compliant; Country of Origin: Mainland China; Diameter: 5mm; Export Control Classification Number (ECCN) Code: EAR99; Harmonized Tariff Schedule (HTS) Code: 8533.21.00.90; Introduction Date: 2010-12-31; Length: 15.5mm; Lifecycle Status: Production; Max Operating Temperature: 155°C; Min Operating Temperature: -55°C; Number of Terminals: 2; Packaging: Tape and Reel; Power Dissipation: 2W; Power Rating: 2W; REACH SVHC: Yes; Resistance: 100kΩ; Termination: Axial; Tolerance: 1%; Voltage Rating (DC): 500V; Working Voltage: 500V; ComponentLink1URL: https://datasheet.octopart.com:443/MFR200FRF73-100K-Yageo-datasheet-175665672.pdf?src-supplier=IHS; ComponentLink1Description: https://datasheet.octopart.com:443/MFR200FRF73-100K-Yageo-datasheet-175665672.pdf?src-supplier=IHS; ComponentLink2URL: https://datasheet.octopart.com/MFR200FRF73-100K-Yageo-datasheet-28066692.pdf; ComponentLink2Description: https://datasheet.octopart.com/MFR200FRF73-100K-Yageo-datasheet-28066692.pdf; ComponentLink3URL: http://sigma.octopart.com:80/conflict_mineral_statement/Yageo-company-3.pdf?src-supplier=Compliance+Statements; ComponentLink3Description: http://sigma.octopart.com:80/conflict_mineral_statement/Yageo-company-3.pdf?src-supplier=Compliance+Statements; ComponentLink4URL: http://sigma.octopart.com:80/rohs_statement/Yageo-company-2.pdf?src-supplier=Compliance+Statements; ComponentLink4Description: http://sigma.octopart.com:80/rohs_statement/Yageo-company-2.pdf?src-supplier=Compliance+Statements